# Altium schematic sheet dc-dc.SchDoc
size 420 x 297 mm; Address1: Address1; Address2: Address2; Address3: Address3; Address4: Address4
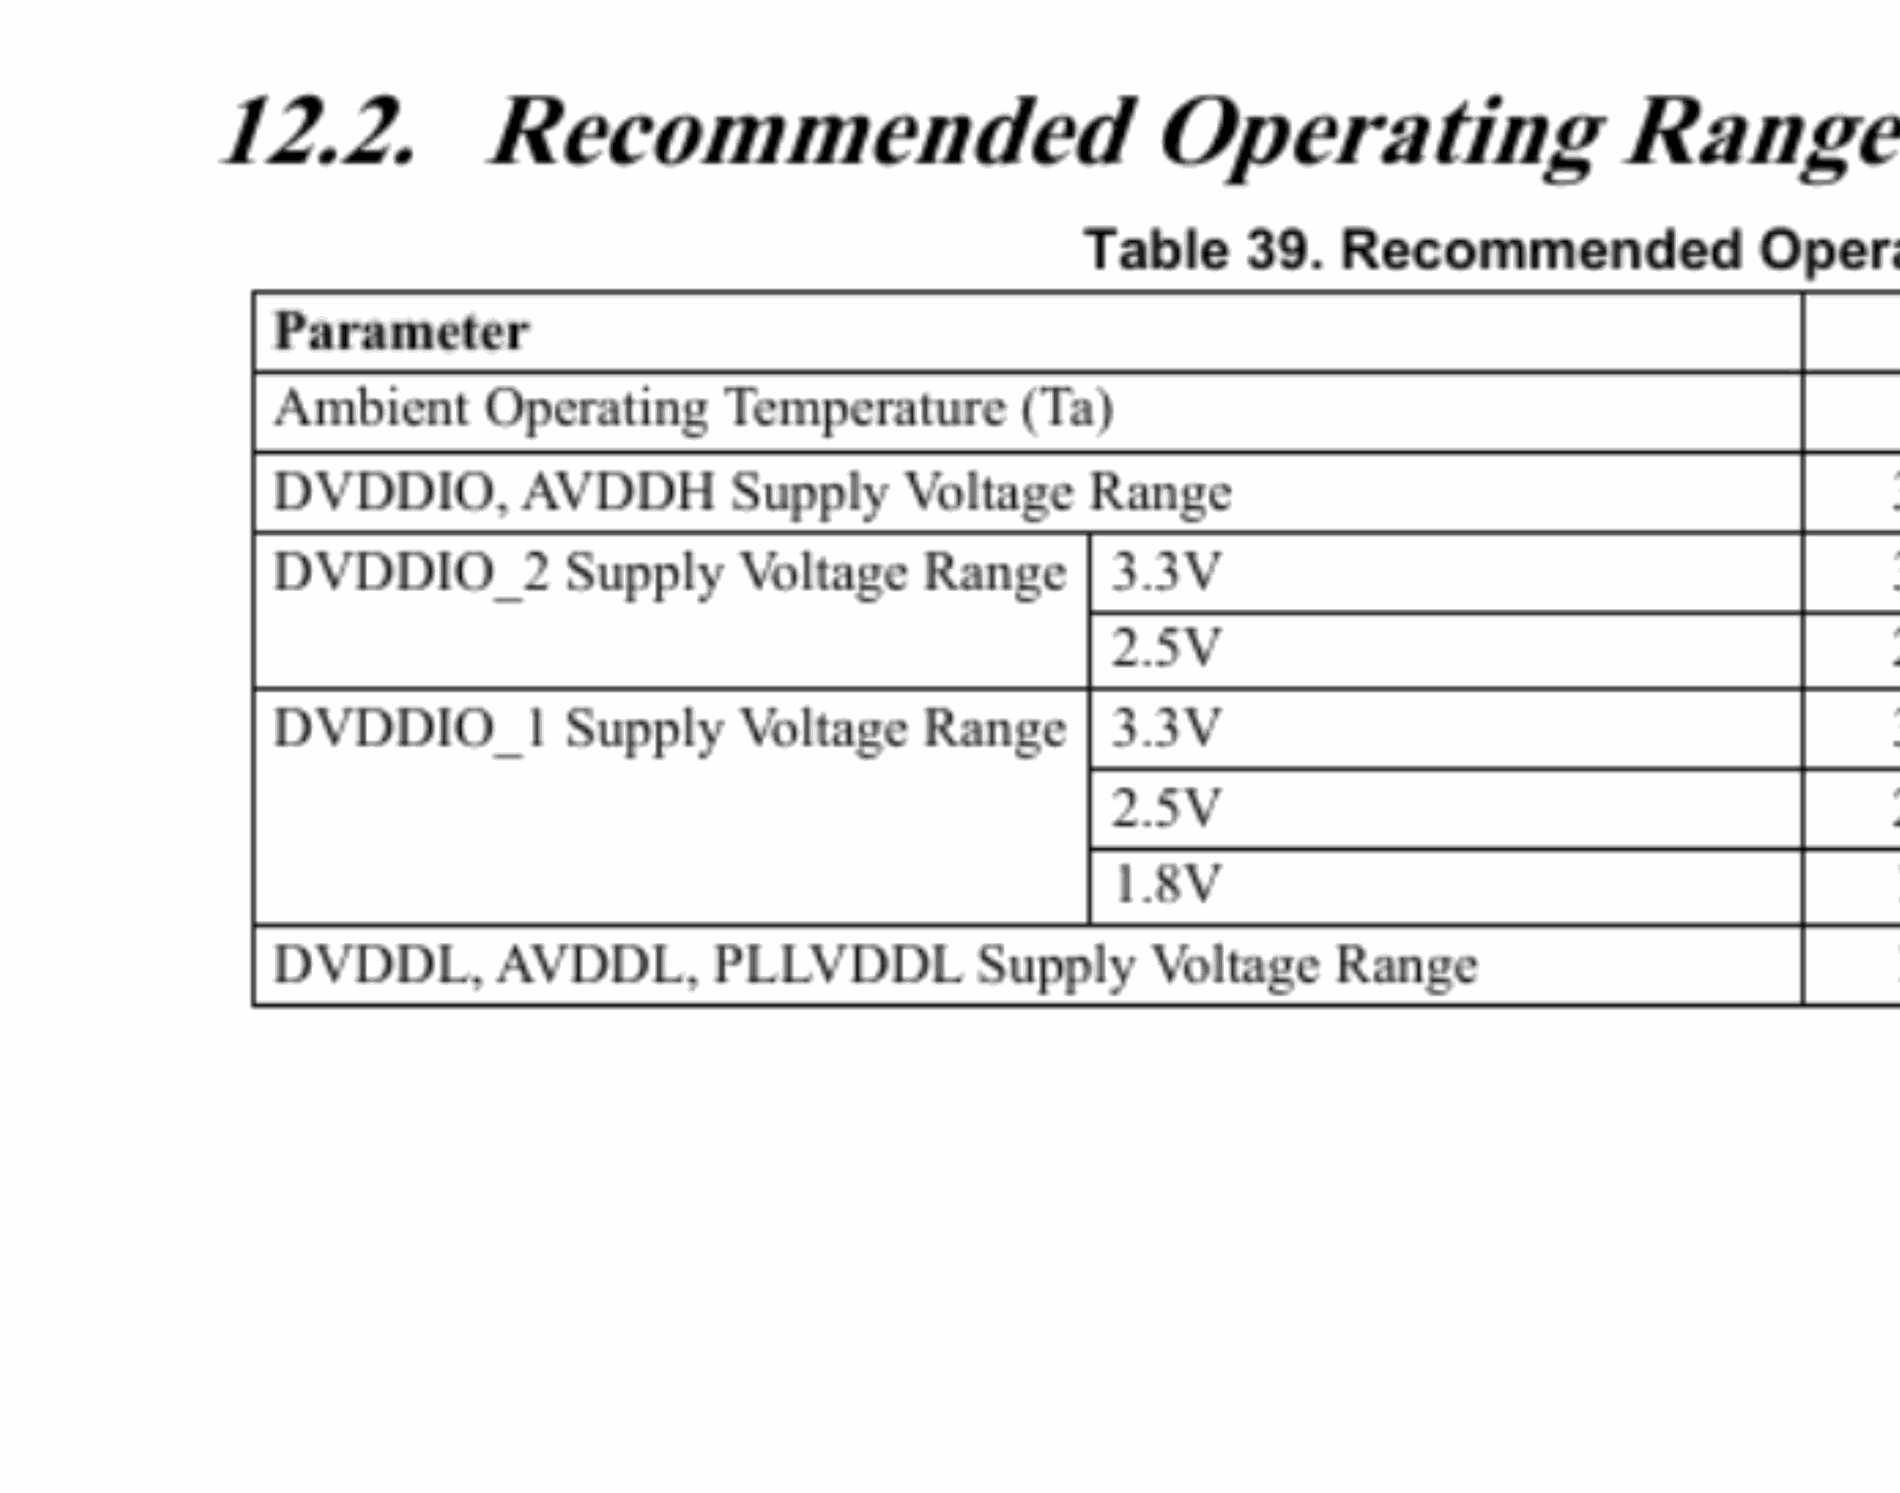
[diagram p0: dc-dc.SchDoc, top left]
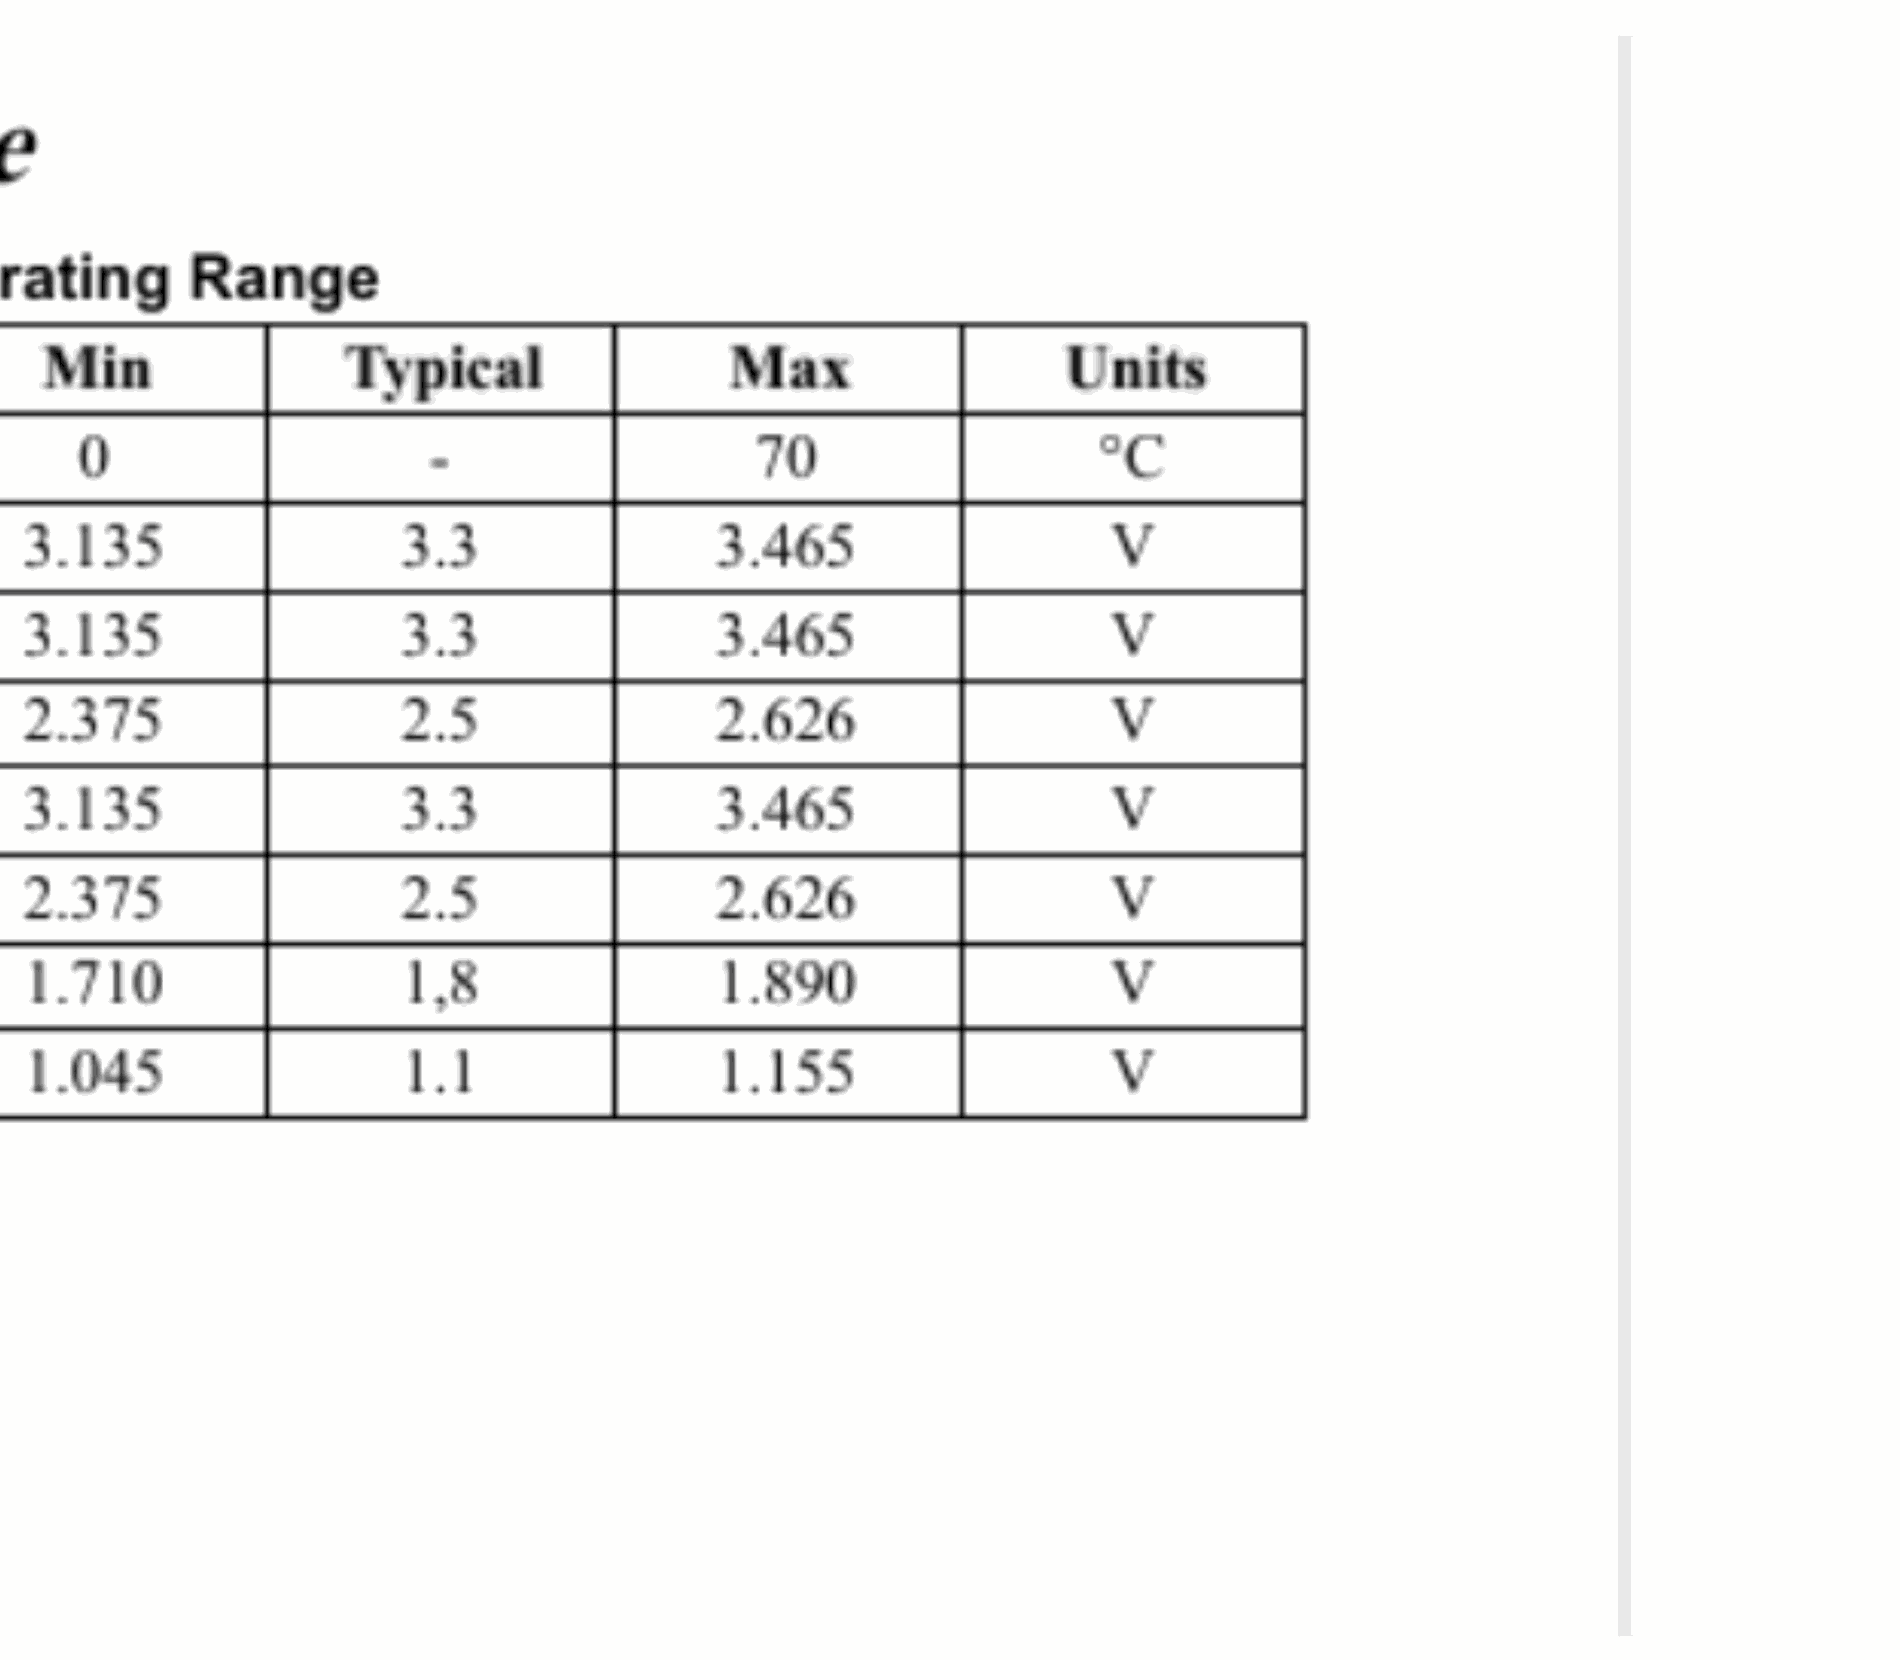
[diagram p1: dc-dc.SchDoc, top right]
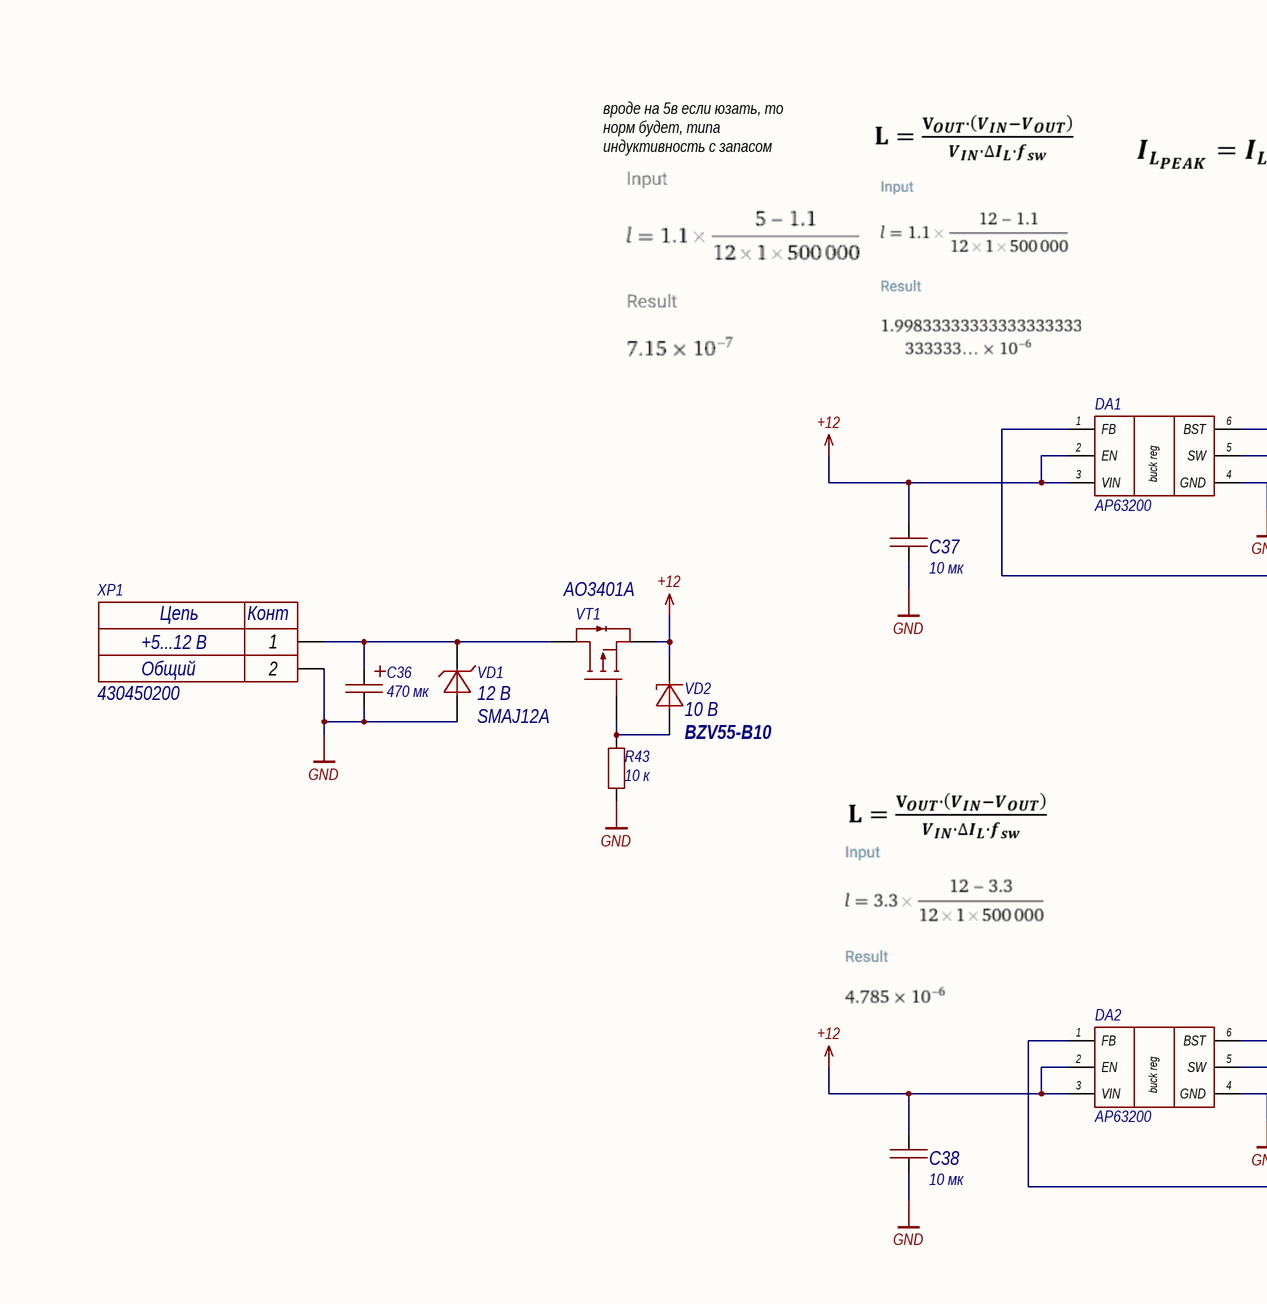
[diagram p2: dc-dc.SchDoc, bottom left]
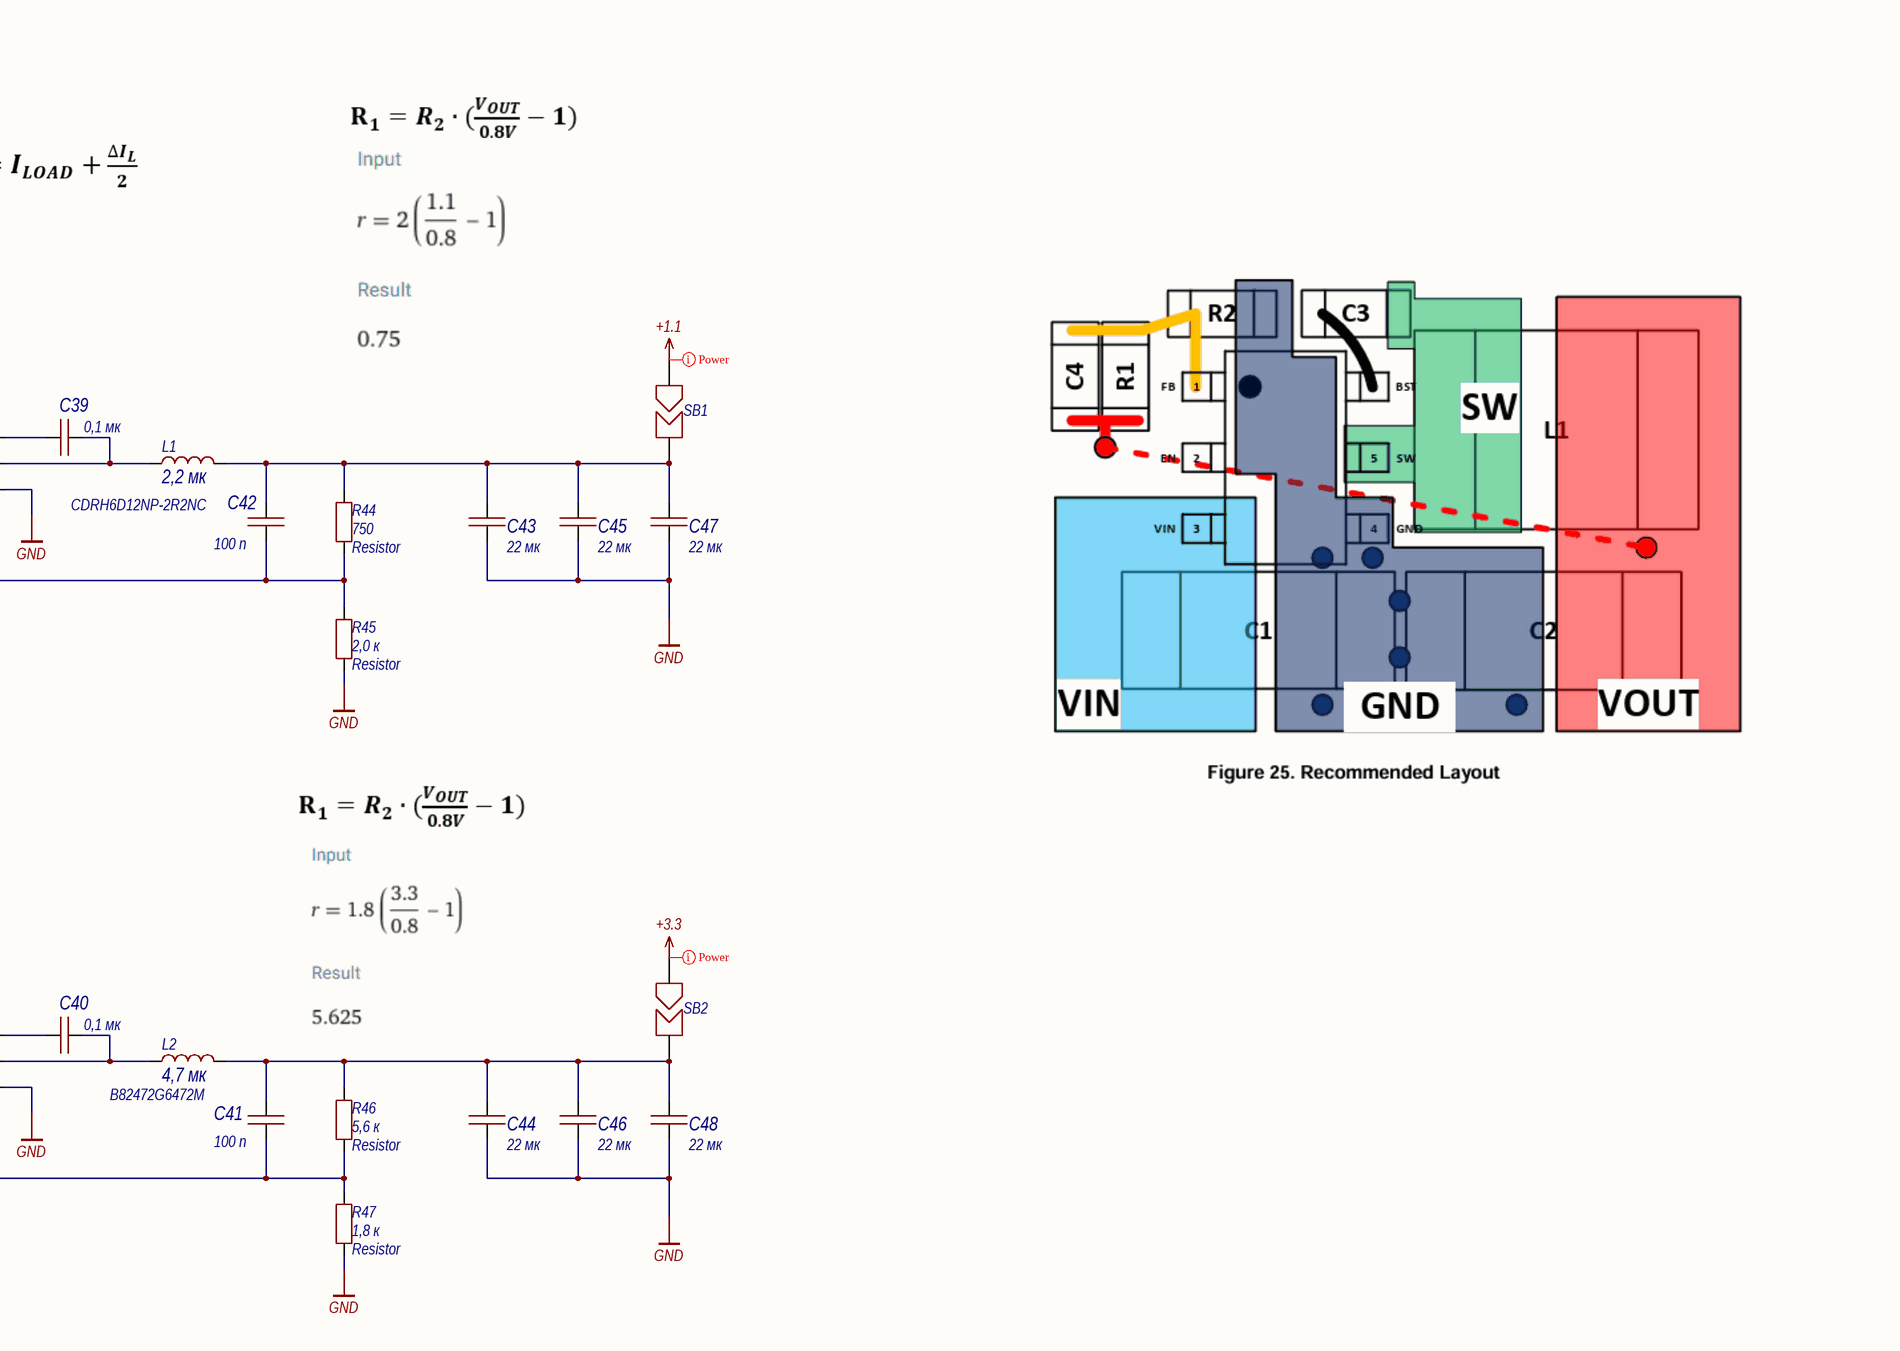
[diagram p3: dc-dc.SchDoc, bottom right]

## Parts
C36  value 470 мк  [ECAP_SMD_10,3x10,3]  (hidden comment: Capacitor_polar)
C37  value 10 мк  [1210C]  (hidden comment: Capacitor)
C38  value 10 мк  [1210C]  (hidden comment: Capacitor)
C39  value 0,1 мк  [0603C]  (hidden comment: Capacitor)
C40  value 0,1 мк  [0603C]  (hidden comment: Capacitor)
C41  value 100 п  [0603C]  (hidden comment: Capacitor)
C42  value 100 п  [0603C]  (hidden comment: Capacitor)
C43  value 22 мк  [1210C]  (hidden comment: Capacitor)
C44  value 22 мк  [1210C]  (hidden comment: Capacitor)
C45  value 22 мк  [1210C]  (hidden comment: Capacitor)
C46  value 22 мк  [1210C]  (hidden comment: Capacitor)
C47  value 22 мк  [1210C]  (hidden comment: Capacitor)
C48  value 22 мк  [1210C]  (hidden comment: Capacitor)
DA1  AP63200  [TSOT26]
DA2  AP63200  [TSOT26]
L1  CDRH6D12NP-2R2NC  value 2,2 мк  [CDRH6D12]
L2  B82472G6472M  value 4,7 мк  [B82462G4]
R43  value 10 к  [0603R]  (hidden comment: Resistor)
R44  Resistor  value 750  [0603R]
R45  Resistor  value 2,0 к  [0603R]
R46  Resistor  value 5,6 к  [0603R]
R47  Resistor  value 1,8 к  [0603R]
SB1  SB  [0805SB]  (value not drawn)  (net tie, no BOM)
SB2  SB  [0805SB]  (value not drawn)  (net tie, no BOM)
VD1  SMAJ12A  value 12 В  [SMA]
VD2  BZV55-B10  value 10 В  [mini_MELF_3.5mm]
VT1  AO3401A  [SOT23-3]
XP1  430450200  Value2: Общий  Value1: +5...12 В  [MOLEX_MICRO-FIT_430450200]

## Nets
+1.1: SB1.1
+3.3: SB2.1
+12: C37.2 C38.2 DA1.2(EN) DA1.3(VIN) DA2.2(EN) DA2.3(VIN) VD2.2 VT1.2
GND: C36.2 C37.1 C38.1 C43.1 C44.1 C45.1 C46.1 C47.1 C48.1 DA1.4(GND) DA2.4(GND) R43.1 R45.1 R47.1 VD1.1 XP1.2
NetC36_1: C36.1 VD1.2 VT1.3 XP1.1
NetC39_1: C39.1 DA1.6(BST)
NetC39_2: C39.2 DA1.5(SW) L1.1
NetC40_1: C40.1 DA2.6(BST)
NetC40_2: C40.2 DA2.5(SW) L2.1
NetC41_1: C41.1 DA2.1(FB) R46.1 R47.2
NetC41_2: C41.2 C44.2 C46.2 C48.2 L2.2 R46.2 SB2.2
NetC42_1: C42.1 DA1.1(FB) R44.1 R45.2
NetC42_2: C42.2 C43.2 C45.2 C47.2 L1.3 R44.2 SB1.2
NetR43_2: R43.2 VD2.1 VT1.1

## Layout directives
net class Power: +1.1, +3.3

## Notes on the sheet
- вроде на 5в если юзать, то норм будет, типа индуктивность с запасом
- Перв. примен.
- Справ. №
- Подп. и дата
- Инв. № дубл.
- Взам. инв. №
- Инв. № подл.
- Изм.
- Лист
- № докум.
- Подп.
- Дата
- Копировал
- Формат А3
- (in symbol 430450200) Цепь; Конт
- (in symbol AP63200) buck reg

## Library data of the parts
C36 = CK016M471G10PKKKV00R: Конденсатор алюминиевый электролитический 470мкФ 16В ±20% (10х10)мм SMD 460мА 2000часов 105°C; Tolerance: 20; Voltage (V): 16; Type: SMD Aluminum; Capacity (uF): 470; Автор: rreali; Datasheet: https://cdn.promelec.ru/upload/items/2023/12/25/suscon-ck.pdf; Part Number: CK016M471G10PKKKV00R
C37 C38 = Capacitor_10u_10_35V_X7R_1210C: Конденсатор 1210C ёмкостью 10 мк 10%, 35 В, X7R; Voltage (V): 35; Capacity (nF): 10000; Part Number: Capacitor_10u_10_35V_X7R_1210C; Tolerance: 10%; Dielectric: X7R
C39 C40 = Capacitor_0,1u_10_50V_X7R_0603C: Конденсатор 0603C ёмкостью 0,1 мк 10%, 50 В, X7R; Voltage (V): 50; Capacity (nF): 100; Part Number: Capacitor_0,1u_10_50V_X7R_0603C; Tolerance: 10%; Dielectric: X7R
C41 C42 = Capacitor_100p_10_50V_X7R_0603C: Конденсатор 0603C ёмкостью 100 п 10%, 50 В, X7R; Voltage (V): 50; Capacity (nF): 0,1; Part Number: Capacitor_100p_10_50V_X7R_0603C; Tolerance: 10%; Dielectric: X7R
C43-C48 = Capacitor_22u_10_25V_X7R_1210C: Конденсатор 1210C ёмкостью 22 мк 10%, 25 В, X7R; Voltage (V): 25; Capacity (nF): 22000; Part Number: Capacitor_22u_10_25V_X7R_1210C; Tolerance: 10%; Dielectric: X7R
DA1 DA2 = AP63200: DC-DC понижающий преобразователь, Vin: 3.8 - 40 В, adj, 2 А; Part Number: AP63200
L1 = CDRH6D12NP-2R2NC: Индуктивность на 2,2 мкГн, номинальный ток 2,5 А; Inductance (μH): 2,2; Current: 2,5 А; Автор: rreali; Part Number: CDRH6D12NP-2R2NC
L2 = B82472G6472M: Индуктивность на 4,7 мкГн, номинальный ток 2,5 А; Inductance (μH): 4,7; Current: 2,5 А; Автор: rreali; Part Number: B82472G6472M
R43 = Resistor_10k_1_0603: Резистор номиналом 10 кОм 1%; Power: *; Part Number: Resistor_10k_1_0603; Tolerance: 1%
R44 = Resistor_750_1_0603: Резистор номиналом 750 Ом 1%; Power: *; Part Number: Resistor_750_1_0603; Tolerance: 1%
R45 = Resistor_2.0k_1_0603: Резистор номиналом 2,0 кОм 1%; Power: *; Part Number: Resistor_2.0k_1_0603; Tolerance: 1%
R46 = Resistor_5.6k_1_0603: Резистор номиналом 5,6 кОм 1%; Power: *; Part Number: Resistor_5.6k_1_0603; Tolerance: 1%
R47 = Resistor_1.8k_1_0603: Резистор номиналом 1,8 кОм 1%; Power: *; Part Number: Resistor_1.8k_1_0603; Tolerance: 1%
SB1 SB2 = SB: Solder bridge, мост припоя, запаиваемая перемычка, net tie, jumper; Автор: rreali; Part Number: SB
VD1 = SMAJ12A: Защитный диод на 12 В, рассеиваемая мощность 400 Вт; Voltage (V): 12; Power (W): 400; Автор: rreali; Part Number: SMAJ12A
VD2 = BZV55-B10: Стабилитрон 10В, 2%, 0.5Вт; Power (W): 0.5; Accuracy: 0,02; Автор: rreali; Voltage (V): 10; Current: 5 мА; Part Number: BZV55-B10; Datasheet: https://cdn.promelec.ru/upload/datasheet/b/7/BZV55_SER.pdf
VT1 = AO3401A: P-канальный MOSFET; Part Number: AO3401A
XP1 = 430450200: Разъем типа провод-плата, угловой, 3 мм, 2 контакт(-ов), Штыревой Разъем, Серия Micro-Fit для монтажа в отверстия; System: Connector; Автор: rreali; Part Number: 430450200; Datasheet: https://www.molex.com/content/dam/molex/molex-dot-com/products/automated/en-us/salesdrawingpdf/430/43045/430450200_sd.pdf?inline